# EAGLE design CP_Watsonville_Mid-Model (EAGLE 7.7.0)
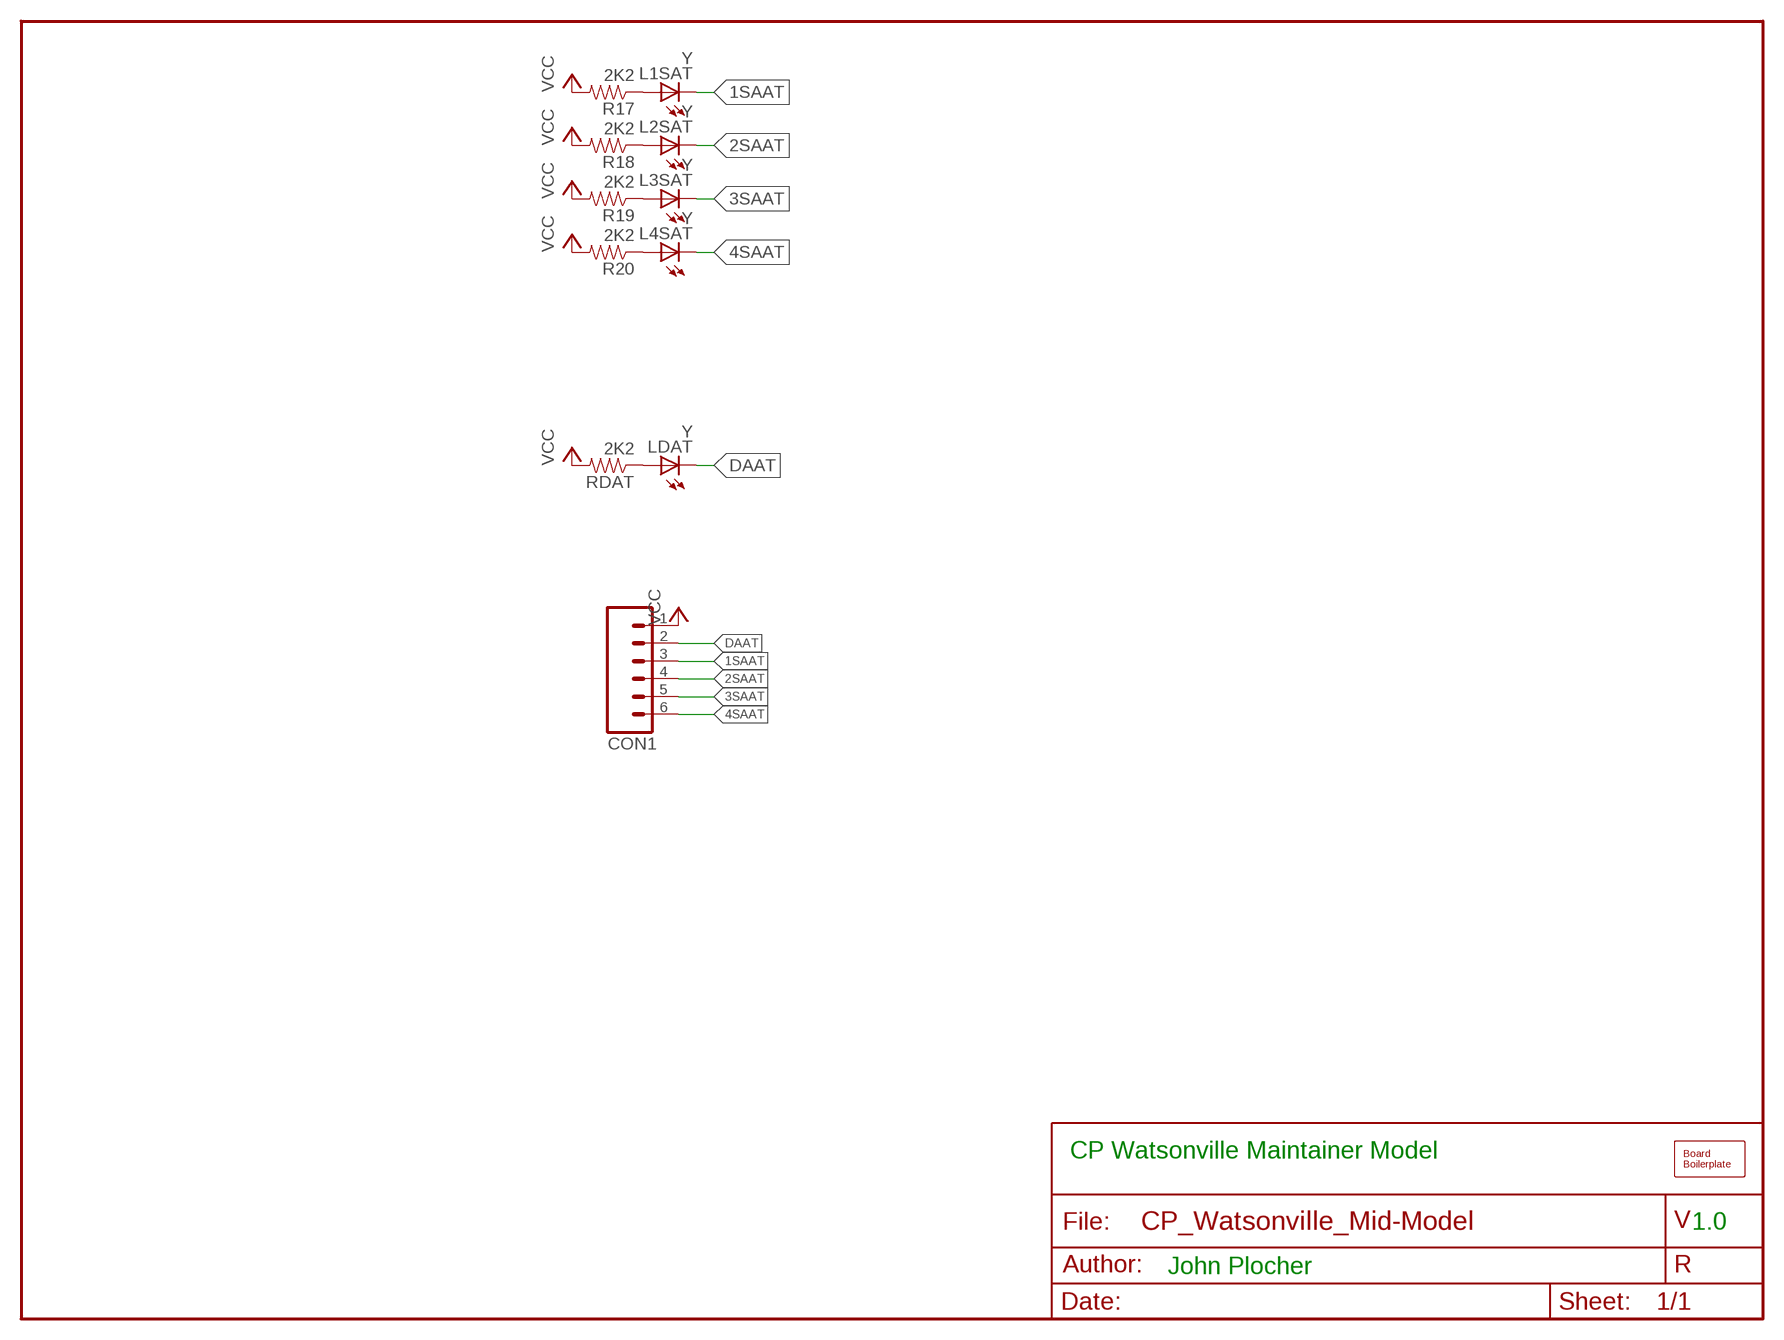
[diagram p0: schematic, sheet 1]

## Parts
BOARD1  BOARD100X100  [BOARD-SEEED10X10]
CON1  CONNECTOR-M06LOCK  [1X06_LOCK]
L1SAT  Y  LED0603-LED  [0603-LED]
L2SAT  Y  LED0603-LED  [0603-LED]
L3SAT  Y  LED0603-LED  [0603-LED]
L4SAT  Y  LED0603-LED  [0603-LED]
LDAT  Y  LED0603-LED  [0603-LED]
R17  2K2  R0603-RES  [0603-RES]
R18  2K2  R0603-RES  [0603-RES]
R19  2K2  R0603-RES  [0603-RES]
R20  2K2  R0603-RES  [0603-RES]
RDAT  2K2  R0603-RES  [0603-RES]

## Nets
1SAAT: CON1.3 L1SAT.C
2SAAT: CON1.4 L2SAT.C
3SAAT: CON1.5 L3SAT.C
4SAAT: CON1.6 L4SAT.C
DAAT: CON1.2 LDAT.C
N$26: LDAT.A RDAT.1
N$27: L1SAT.A R17.1
N$28: L2SAT.A R18.1
N$29: L3SAT.A R19.1
N$30: L4SAT.A R20.1
VCC [power]: CON1.1 R17.2 R18.2 R19.2 R20.2 RDAT.2

## Notes on the sheet
- CP Watsonville Maintainer Model
- 1.0
- John Plocher

## Library data of the parts
BOARD1 = SPCoast:BOARD
CON1 = SPCoast:CONNECTOR-M06: Header 6 Standard 6-pin 0.1" header
L1SAT L2SAT L3SAT L4SAT LDAT = SPCoast:LED*
R17-R20 RDAT = SPCoast:R*: Resistor Basic schematic elements and footprints for 0603, 1206, and PTH 1/10th watt (small) resistors.

## Net classes
0 default: width 0.152 mm, drill 0.4 mm
1 power: width 0.61 mm, drill 1 mm

## Board
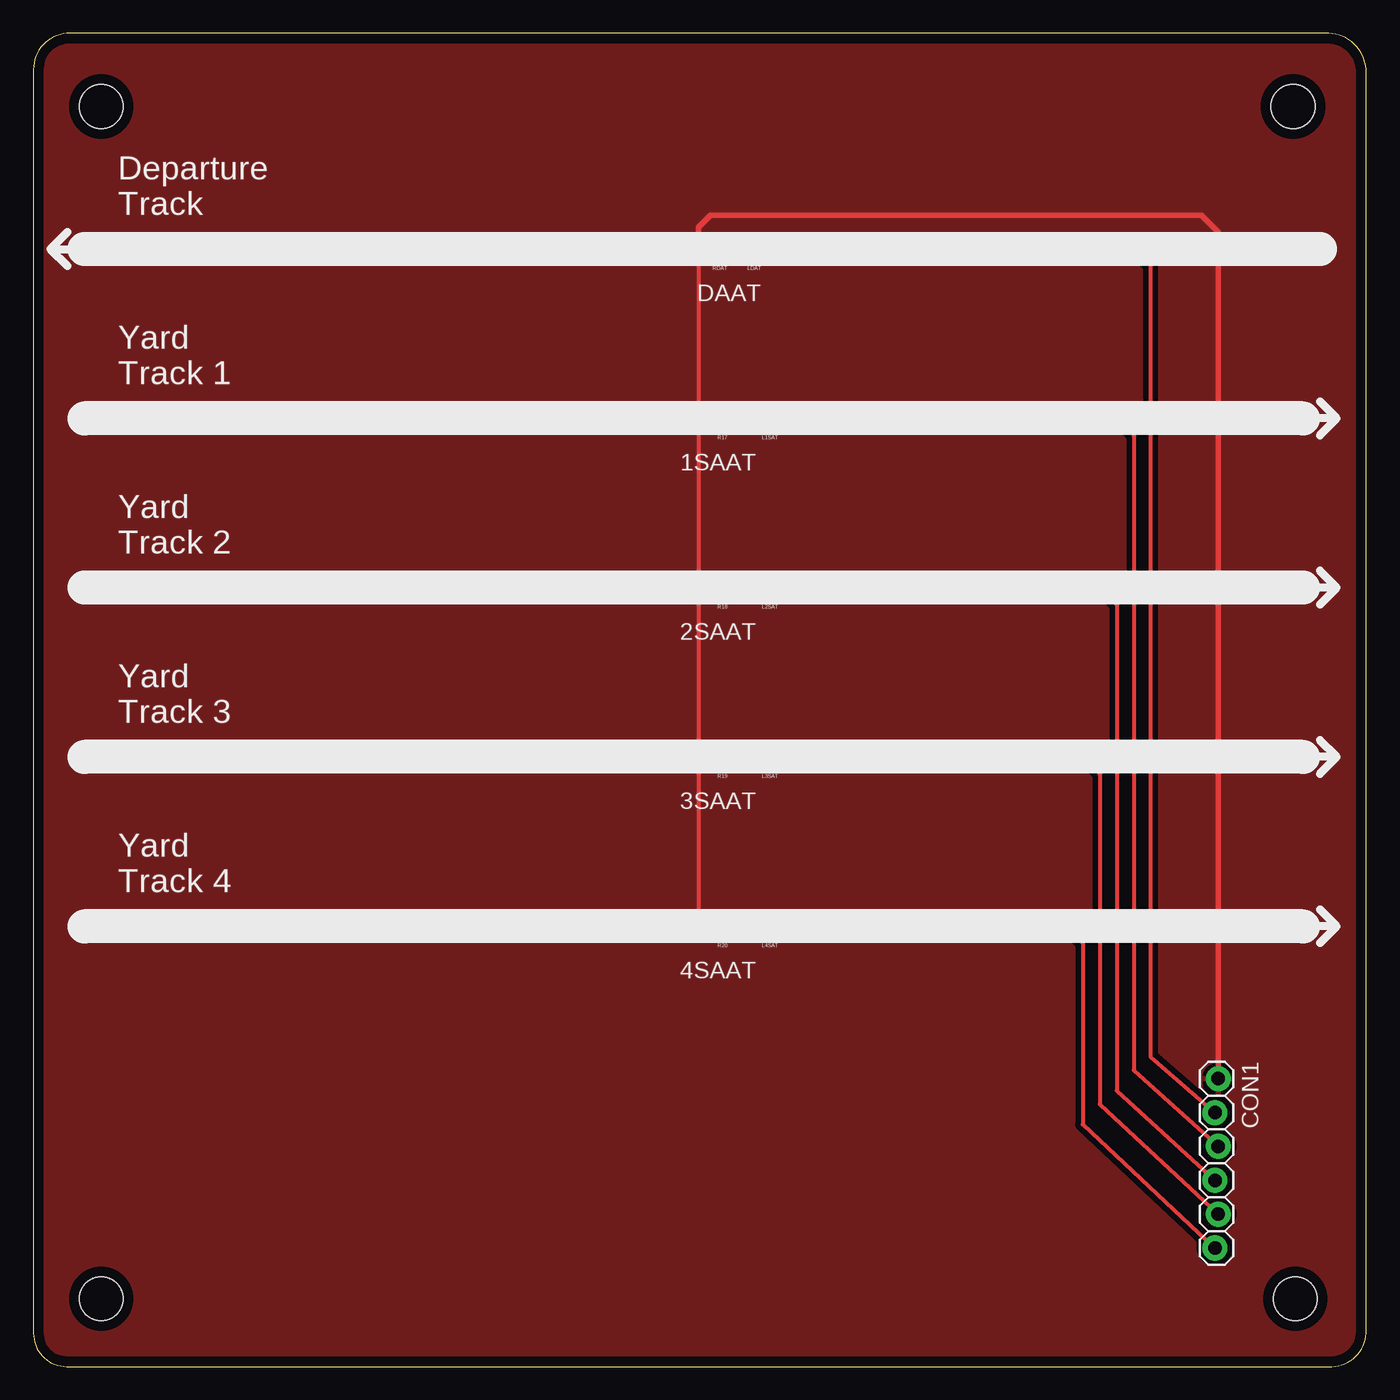
[diagram p1: board, top side]
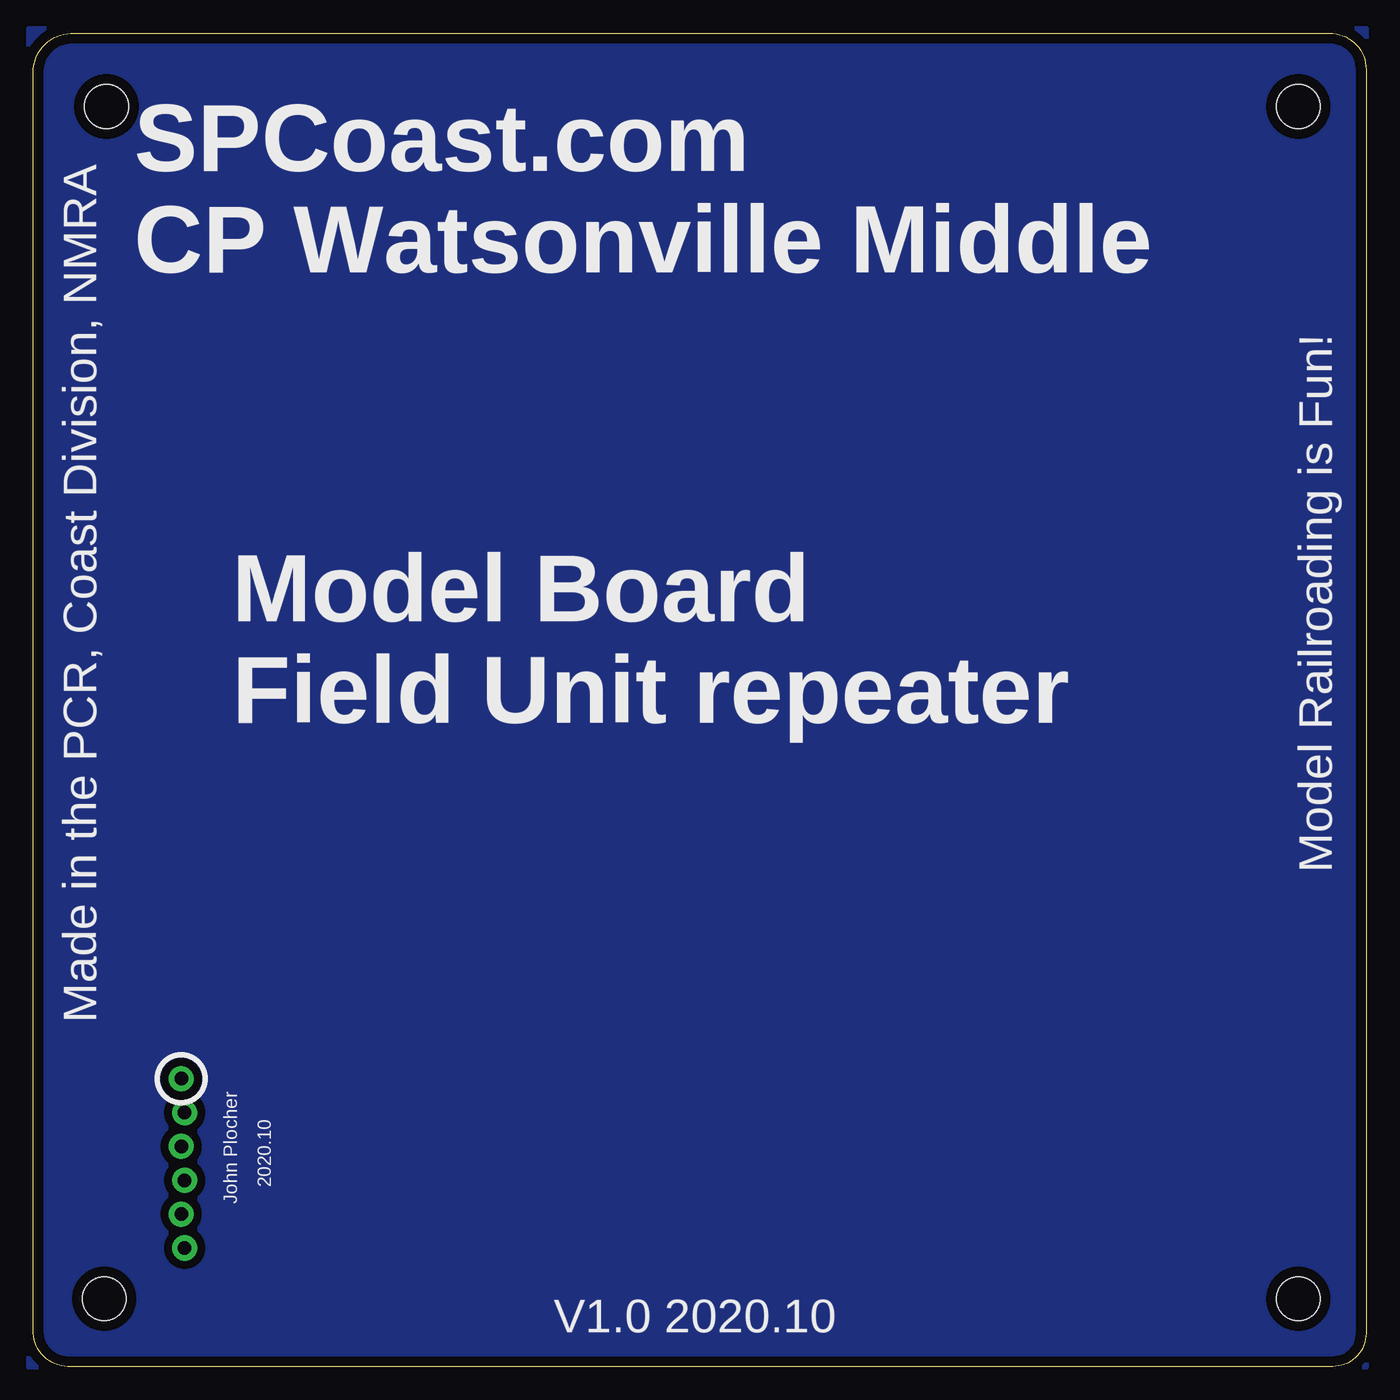
[diagram p2: board, bottom side, seen from below]

Size 100.01 x 100 mm. Coordinates in mm from the lower left corner, seen from the top.
Copper layers (1*16): Top 0.035mm / dielectric 1.5mm / Bottom 0.035mm
Design rules "jlcpcb *": minimum track width 5mil, minimum drill 0.3mm, track to track 5mil, track to pad 0.2mm, pad to pad 0.54mm, via to via 0.54mm, smd to smd 5mil, copper to edge 30mil, drill to drill 10mil, minimum pad ring 0.13mm, minimum via ring 0.13mm, stop-mask expansion 4mil, vias tented up to drill 0mil, thermal gap 10mil

### Footprints (pad centres in the part's own frame; a part is rotated, then mirrored left to right if it is on the bottom)
BOARD-SEEED10X10 = hole 3.3: 94.676,5.08; 5.08,94.5; 94.5,94.5; 5.08,5.08
1X06_LOCK = drill 1.016 pad 1.88: 1 0,0; 2 2.54,-0.254; 3 5.08,0; 4 7.62,-0.254; 5 10.16,0; 6 12.7,-0.254
0603-LED = smd 0.8 x 0.8: A 0.75,0; C -0.75,0
0603-RES = smd 0.813 x 0.813: 1 -0.9,0; 2 0.9,0

### Placement (x,y rotation side)
BOARD1  0.01,0 0 top
CON1  88.91,21.59 270 top
L1SAT  54.62,71.12 180 top
L2SAT  54.62,58.42 180 top
L3SAT  54.62,45.72 180 top
L4SAT  54.62,33.02 180 top
LDAT  53.35,83.82 180 top
R17  50.81,71.12 180 top
R18  50.81,58.42 180 top
R19  50.81,45.72 180 top
R20  50.81,33.02 180 top
RDAT  50.81,83.82 180 top

### Tracks (layer width: path | path; a pad name or v marks a point on that pad's centre or on a via)
1SAAT
  Top 0.305: L1SAT.C 81.29,71.12 82.56,69.85 82.56,22.23 CON1.3
2SAAT
  Top 0.305: L2SAT.C 80.02,58.42 81.29,57.15 81.29,20.7 CON1.4
3SAAT
  Top 0.305: L3SAT.C 78.75,45.72 80.02,44.45 80.02,19.69 CON1.5
4SAAT
  Top 0.305: L4SAT.C 77.48,33.02 78.75,31.75 78.75,18.16 CON1.6
DAAT
  Top 0.305: LDAT.C 82.56,83.82 83.83,82.55 83.83,23.24 CON1.2
GND
  pour Bottom (isolate 0.61): 0.01,100.33 0.01,0 100.34,0 100.34,100.33
N$26
  Top 0.305: LDAT.A RDAT.1
N$27
  Top 0.305: R17.1 L1SAT.A
N$28
  Top 0.305: R18.1 L2SAT.A
N$29
  Top 0.305: R19.1 L3SAT.A
N$30
  Top 0.305: R20.1 L4SAT.A
VCC
  Top 0.305: RDAT.2 R17.2 R18.2 R19.2 R20.2
  Top 0.406: CON1.1 88.91,85.09 87.64,86.36 50.81,86.36 49.91,85.46 RDAT.2
  pour Top (isolate 0.406, rank 2): 0.01,99.83 0.01,0 100.34,0 100.34,99.83

### Text on the board
tPlace: Departure / Track | DAAT | Yard / Track 1 | 1SAAT | Yard / Track 2 | 2SAAT | Yard / Track 3 | 3SAAT | Yard / Track 4 | 4SAAT
bPlace: Made in the PCR, Coast Division, NMRA | SPCoast.com / CP Watsonville Middle | Model Railroading is Fun! | Model Board / Field Unit repeater | 2020.10 | John Plocher | V1.0 2020.10